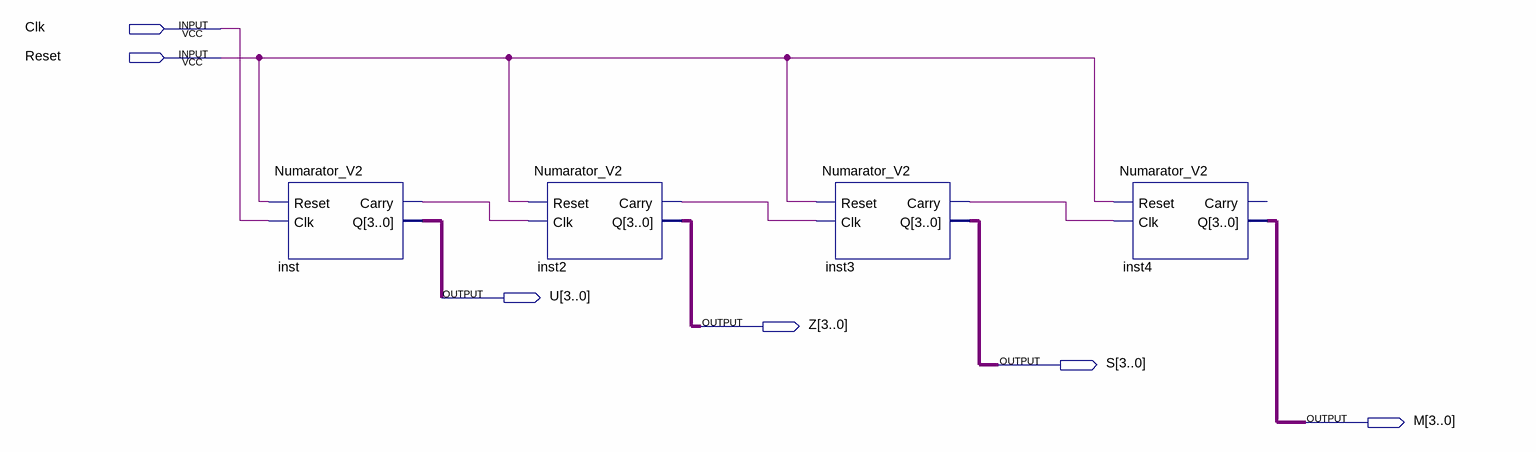
[diagram p0: schematic sheet]
// Quartus schematic Bloc_Numarare_V2.bdf as structural Verilog: 4 symbols, 6 pins
module Bloc_Numarare_V2 (
  input  Clk,
  input  Reset,
  output [3:0] U,
  output [3:0] Z,
  output [3:0] S,
  output [3:0] M
);

  wire inst2_carry, inst3_carry, inst_carry;

  Numarator_V2 inst (.Reset(Reset), .Clk(Clk), .Carry(inst_carry), .Q(U));
  Numarator_V2 inst2 (.Reset(Reset), .Clk(inst_carry), .Carry(inst2_carry), .Q(Z));
  Numarator_V2 inst3 (.Reset(Reset), .Clk(inst2_carry), .Carry(inst3_carry), .Q(S));
  Numarator_V2 inst4 (.Reset(Reset), .Clk(inst3_carry), .Q(M));  // open: Carry
endmodule
